# Altium schematic sheet MIPI_Interface.SchDoc
size A4; SheetNumber: 3; SheetTotal: 6
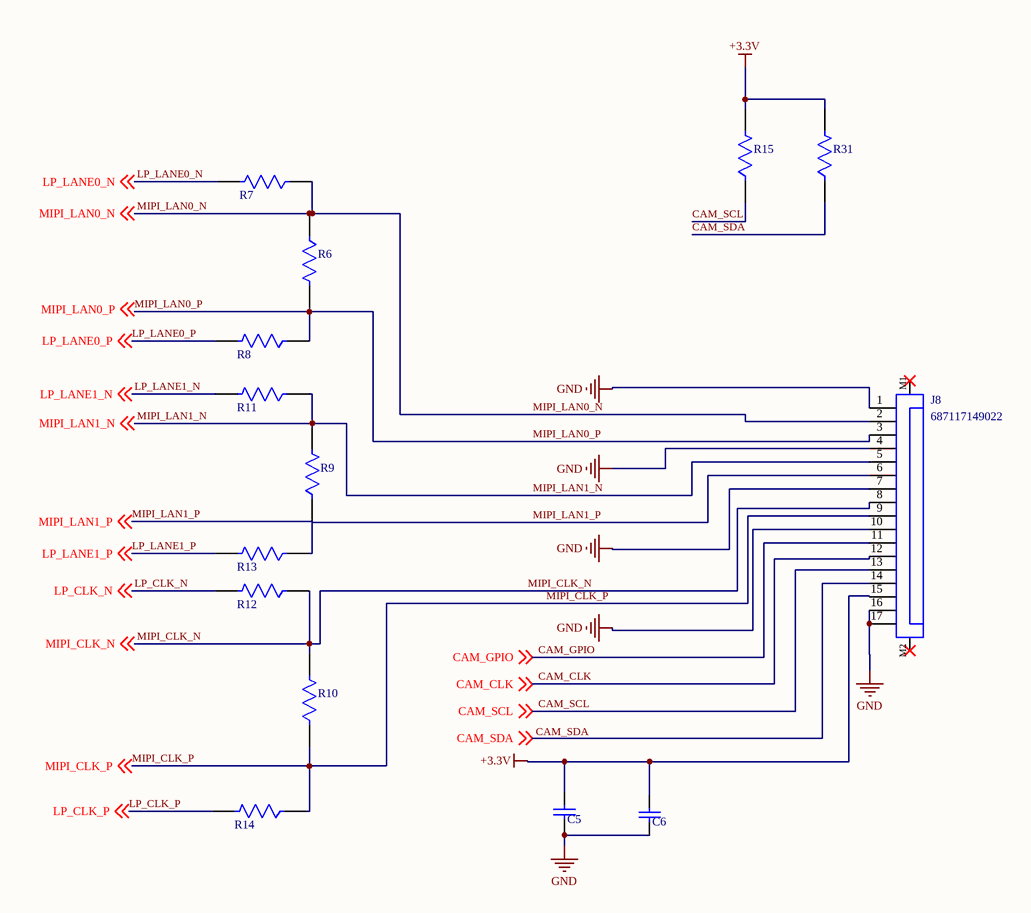
[diagram p0: MIPI_Interface.SchDoc]

## Parts
C5  VJ0805Y152KXAAC  [CAPC2013X145X48NL20T23]  (value not drawn)
C6  VJ0805Y152KXAAC  [CAPC2013X145X48NL20T23]  (value not drawn)
J8  687117149022  [687117149022]
R6  MCU0805MD4991BP100  [FP-MCU0805-MFG]  (value not drawn)
R7  MCU0805MD4991BP100  [FP-MCU0805-MFG]  (value not drawn)
R8  MCU0805MD4991BP100  [FP-MCU0805-MFG]  (value not drawn)
R9  MCU0805MD4991BP100  [FP-MCU0805-MFG]  (value not drawn)
R10  MCU0805MD4991BP100  [FP-MCU0805-MFG]  (value not drawn)
R11  MCU0805MD4991BP100  [FP-MCU0805-MFG]  (value not drawn)
R12  MCU0805MD4991BP100  [FP-MCU0805-MFG]  (value not drawn)
R13  MCU0805MD4991BP100  [FP-MCU0805-MFG]  (value not drawn)
R14  MCU0805MD4991BP100  [FP-MCU0805-MFG]  (value not drawn)
R15  MCU0805MD4991BP100  [FP-MCU0805-MFG]  (value not drawn)
R31  MCU0805MD4991BP100  [FP-MCU0805-MFG]  (value not drawn)

## Nets
+3.3V: C5.2 C6.2 J8.15 R15.2 R31.2
GND: C5.1 C6.1 J8.1 J8.4 J8.7 J8.10 J8.16 J8.17
CAM_CLK: J8.12 ; off-sheet CAM_CLK
CAM_GPIO: J8.11 ; off-sheet CAM_GPIO
CAM_SCL: J8.13 R15.1 ; off-sheet CAM_SCL
CAM_SDA: J8.14 R31.1 ; off-sheet CAM_SDA
LP_CLK_N: R12.2 ; off-sheet LP_CLK_N
LP_CLK_P: R14.2 ; off-sheet LP_CLK_P
LP_LANE0_N: R7.2 ; off-sheet LP_LANE0_N
LP_LANE0_P: R8.2 ; off-sheet LP_LANE0_P
LP_LANE1_N: R11.2 ; off-sheet LP_LANE1_N
LP_LANE1_P: R13.2 ; off-sheet LP_LANE1_P
MIPI_CLK_N: J8.8 R10.2 R12.1 ; off-sheet MIPI_CLK_N
MIPI_CLK_P: J8.9 R10.1 R14.1 ; off-sheet MIPI_CLK_P
MIPI_LAN0_N: J8.2 R6.1 R7.1 ; off-sheet MIPI_LAN0_N
MIPI_LAN0_P: J8.3 R6.2 R8.1 ; off-sheet MIPI_LAN0_P
MIPI_LAN1_N: J8.5 R9.2 R11.1 ; off-sheet MIPI_LAN1_N
MIPI_LAN1_P: J8.6 R9.1 R13.1 ; off-sheet MIPI_LAN1_P

Not connected (* = marked no-connect by the designer): J8 M1* M2*

## Notes on the sheet
- Labels drawn without touching a wire or pin: CAM_SDA, MIPI_LAN0_P

## Library data of the parts
C5 C6 = CMP-2007-01729-1: Manufacturer: Vitramon; Part Number: VJ0805Y152KXAAC
J8 = CMP-1502-01629-3: SMT ZIF Connectors Hinge Type WR-FPC, Horizontal, Bottom Contact, pitch 0.5 mm, 17 pins; Number of Contacts: 17; Voltage Rating: 50V; Wire/Cable Type: Straight; Pitch: 508µm; Actuator Material: Nylon, Polyamide; Contact Resistance: 50mΩ; Gender: Receptacle; Current Rating: 500mA; Packaging: Tape and Reel; REACH SVHC: Unknown; Contact Material: Bronze; Mount: Surface Mount; RoHS: Compliant; Min Operating Temperature: -40°C; Flammability Rating: UL94 V-0; Number of Pins: 17; Number of Rows: 1; Termination: Solder; Number of Positions: 17; Max Operating Temperature: 105°C; Contact Plating: Tin; Orientation: Horizontal; Operating Supply Voltage: 50V; Lead Pitch: 500µm
R6-R15 R31 = CMP-02407-000217-1: RES 1.05K OHM 0.5% 1/5W 0805; Resistance: 4.99kR; Power Rating: 200mW; Tolerance: 0.1%; Voltage Rating: 150V; Weight: 0.000194oz; Package Quantity: 1000; Height: 0.52mm; Case Code (Imperial): 0805; Width: 1.25mm; Packaging: Tape and Reel; Case/Package: 0805; Length: 2mm; Composition: Thin Film; Termination: SMD/SMT; Min Operating Temperature: -55°C; Case Code (Metric): 2012; Max Operating Temperature: 155°C